# Altium schematic sheet schematic_rj45bnc.SchDoc
size A4; Author: Florian Rosner; CompanyName: Technische Hochschule Nürnberg Georg Simon Ohm; Address1: Fürther Straße 250; Address2: 90429 Nürnberg; Address3: GERMANY; SheetNumber: 2; SheetTotal: 2; CompanyName2: Institut ELSYS
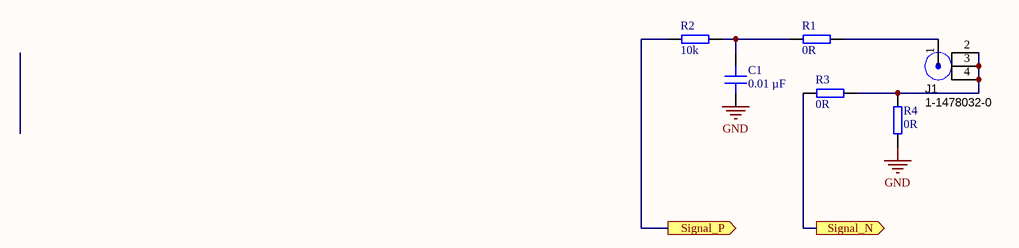
[diagram p0: schematic_rj45bnc.SchDoc]

## Parts
C1  0.01 µF  [C_0805]
J1  1-1478032-0  [Right Angle BNC]
R1  0R  [RES 0805_2012]
R2  10k  [RES 1206_3216]
R3  0R  [RES 0805_2012]
R4  0R  [RES 0805_2012]

## Ports
Signal_N (out), Signal_P (out)

## Nets
GND: C1.1 R4.1
Signal_N: R3.1 ; port Signal_N
Signal_P: R2.1 ; port Signal_P
NetC1_2: C1.2 R1.1 R2.2
NetJ1_1: J1.1 R1.2
NetJ1_2: J1.2 J1.3 J1.4 R3.2 R4.2

## Notes on the sheet
- Title
- Size:
- Date:
- A4
- Revision:
- Time:
- Sheet
- of
- Author:
- Project:

## Library data of the parts
C1 = C0805C103K3RACTU: Capacitor 0805, 25 VDC, 0.01 µF, X7R; Manufacturer: KEMET; Tolerance: 10 %; Voltage Rating: 25 VDC; Created from: MGremer; Manufacturer Part Number: C0805C103K3RACTU; PartID: 20; Created On: 20.12.2020 13:54:13; ComponentLink1Description: Datasheet; ComponentLink1URL: https://www.mouser.de/datasheet/2/212/KEM_C1002_X7R_SMD-1102033.pdf; Component Type: Capacitor 0805; Device Package: 0805; Last Updated: 17.11.2021 11:24:29; Mounting Type: SMD; Operating Temperature: -55 - 125°C; Series: SMD Comm X7R; Supplier 1: Mouser; Supplier Part Number 1: 80-C0805C103K3R; Type: Capacitor; Value: 0.01 µF; Live Cycle Status: 1; Stock number: Labor SMD Container
J1 = 1-1478032-0: BNC Connector; Manufacturer: TE; PartNumber: Used in BOM report; SymbolVersion: use current date i.e. 2008-05-20; SymbolCreator: Use LDAP id; CompType: Used in some BOM reports.  Useful for finding later.; U/M: EA, IN, or GM; Created from: FSchoenig, MGremer; MountType: SMT, TH, or N/A; RoHS: Used in BOM report.  Use Y or N.; PackageReference: eg:  0603, used in PnP report; ComponentLink1Description: Datasheet; ComponentLink1URL: https://www.te.com/commerce/DocumentDelivery/DDEController?Action=showdoc&DocId=Data+Sheet%7F6-1773448-5_ZDC_RF_COAX_50-75_OHM%7F1007%7Fpdf%7FEnglish%7FENG_DS_6-1773448-5_ZDC_RF_COAX_50-75_OHM_1007.pdf&src-supplier=Avnet; Alternate PartNumber: -; Alternate Manufacturer: -; Supplier 1: Digi-Key; Supplier Part Number 1: A97560-ND; Manufacturer Part Number: 1-1478032-0; PartID: 3; Created On: 12.05.2021 17:41:04; Component Type: BNC; Device Package: BNC; Last Updated: 24.08.2021 10:46:04; Mounting Type: THT; Type: BNC; Live Cycle Status: 1; Stock number: not stored
R1 R3 R4 = RC0805JR-100RL: SMD resistor 5%; Manufacturer: Yageo; Created from: MGremer; Manufacturer Part Number: RC0805JR-100RL; PartID: 186; Created On: 14.12.2020 16:17:14; ComponentLink1Description: Datasheet; ComponentLink1URL: https://www.mouser.com/catalog/specsheets/Yageo-03-18-2021-PYu-RC_Group_51_RoHS_L_11.pdf; Component Type: SMD resistor; Device Package: 0805; Last Updated: 14.12.2020 18:22:52; Mounting Type: SMD; Supplier 1: Mouser; Supplier Part Number 1: 603-RC0805JR-100RL; Type: Resistor; Tolerance: 5%; Value: 0R; Live Cycle Status: 1; Stock number: not stored
R2 = ERJ-8ENF1002V: SMD resistor 1%; Manufacturer: Panasonic; Created from: MGremer; Manufacturer Part Number: ERJ-8ENF1002V; PartID: 201; Created On: 14.12.2020 16:17:14; ComponentLink1Description: Datasheet; ComponentLink1URL: https://www.mouser.de/datasheet/2/315/AOA0000C304-1149620.pdf; Component Type: SMD resistor; Device Package: 1206; Last Updated: 24.01.2021 12:18:37; Mounting Type: SMD; Supplier 1: Mouser; Supplier Part Number 1: 667-ERJ-8ENF1002V; Type: Resistor; Tolerance: 1 %; Value: 10k; Live Cycle Status: 1; Stock number: not stored